# EAGLE design head (EAGLE 7.6.0)
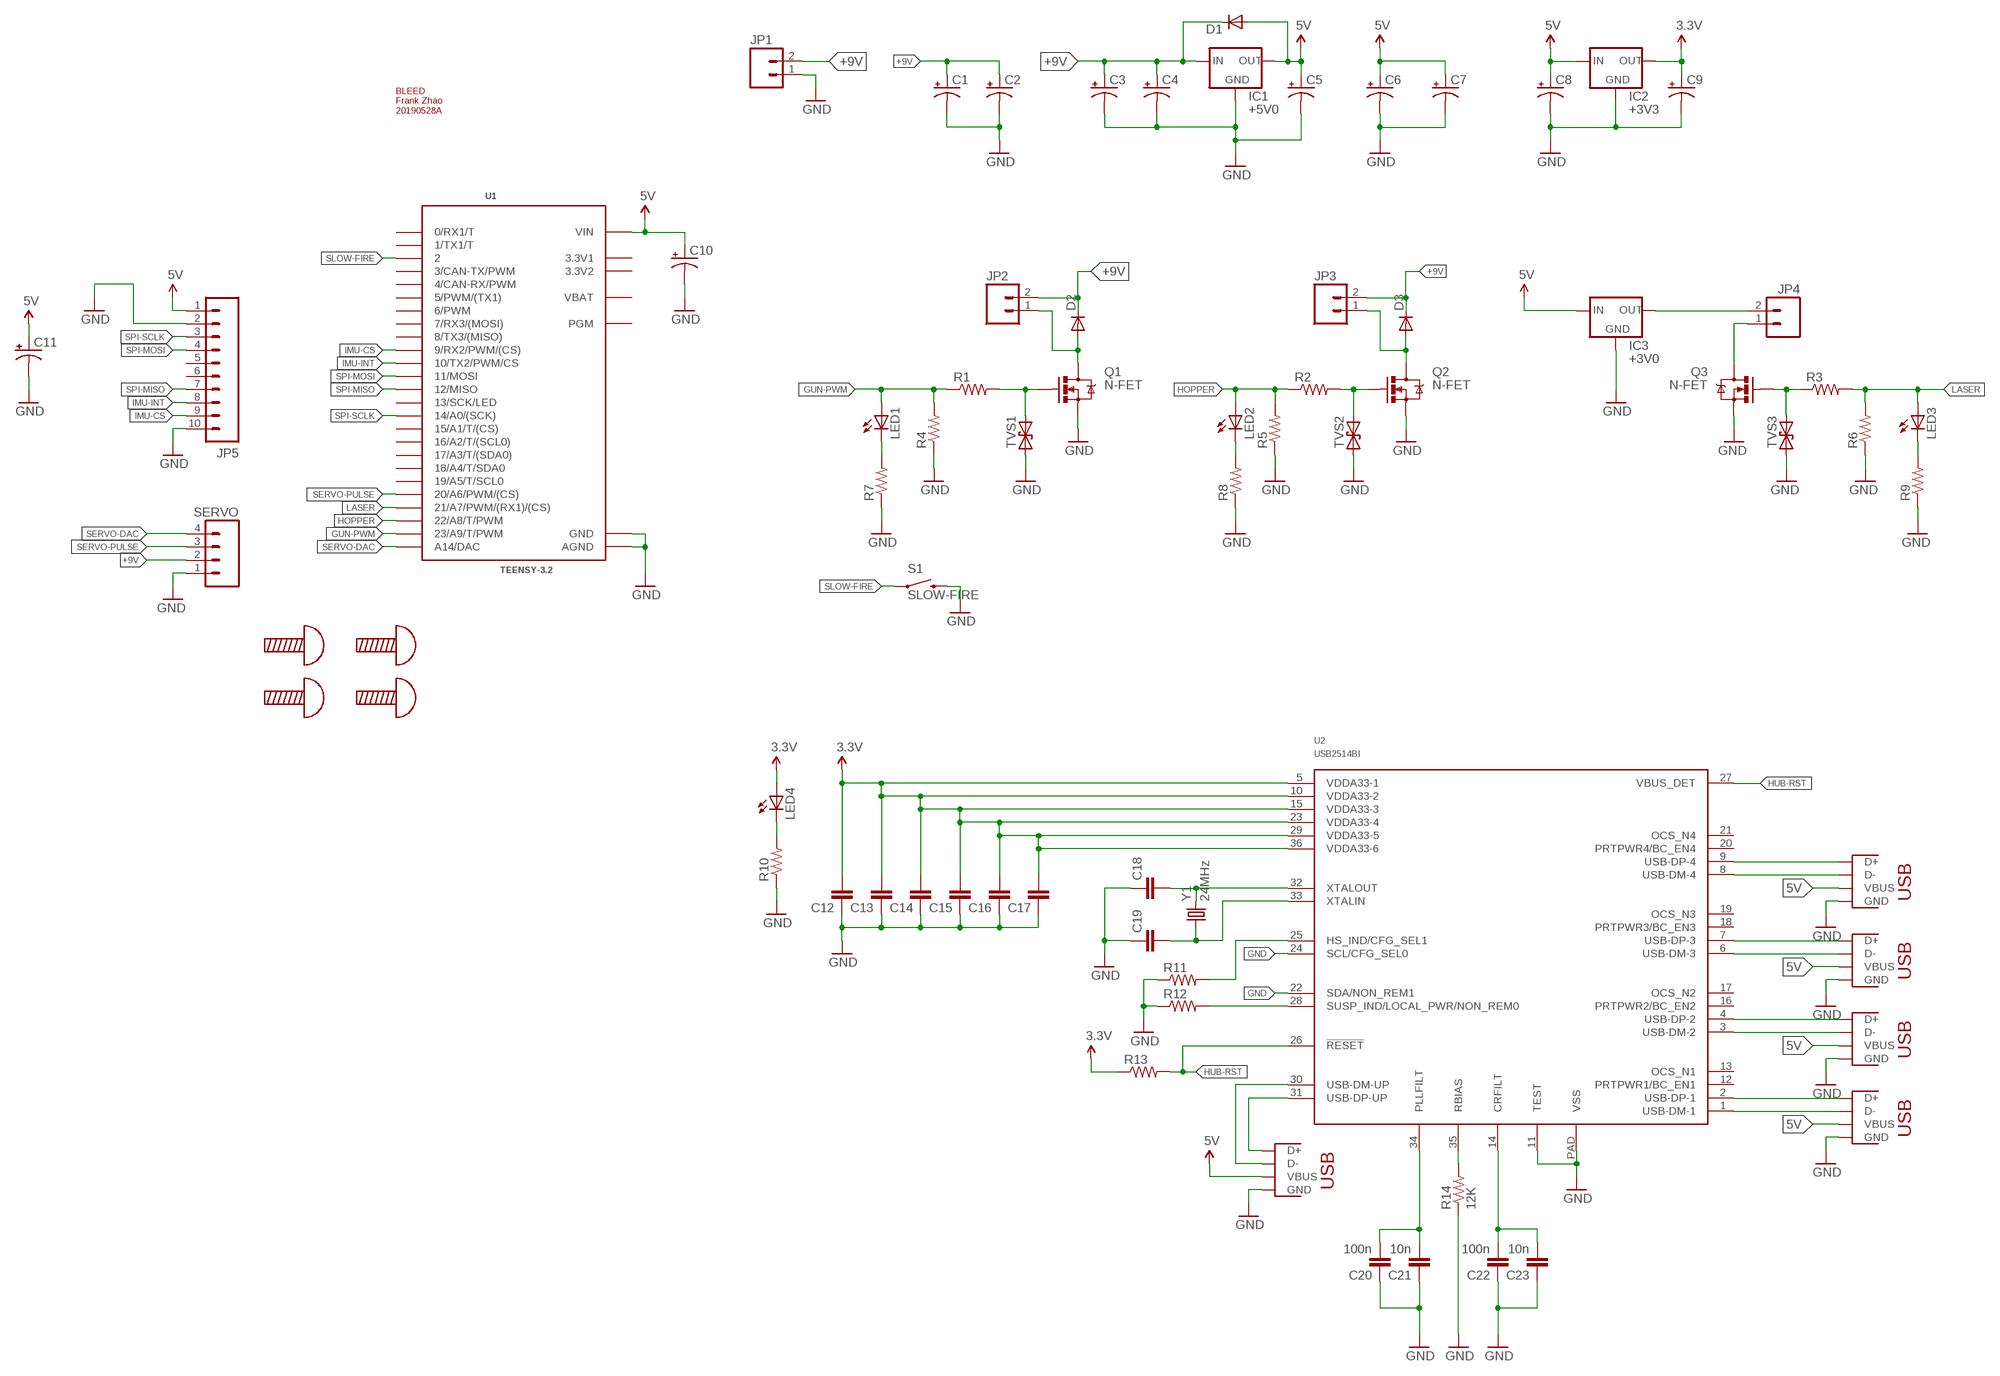
[diagram p0: schematic, sheet 1]

## Parts
C1  CAP_POLPTH4  [CPOL-RADIAL-1000UF-25V]
C2  CAP_POLPTH4  [CPOL-RADIAL-1000UF-25V]
C3  CAP_POLPTH4  [CPOL-RADIAL-1000UF-25V]
C4  CAP_POL1206-KIT  [EIA3216-KIT]
C5  CAP_POL1206-KIT  [EIA3216-KIT]
C6  CAP_POL1206-KIT  [EIA3216-KIT]
C7  CAP_POL1206-KIT  [EIA3216-KIT]
C8  CAP_POL1206-KIT  [EIA3216-KIT]
C9  CAP_POL1206-KIT  [EIA3216-KIT]
C10  CAP_POL1206-KIT  [EIA3216-KIT]
C11  CAP_POL1206-KIT  [EIA3216-KIT]
C12  CAP0402-CAP  [0402-CAP]
C13  CAP0402-CAP  [0402-CAP]
C14  CAP0402-CAP  [0402-CAP]
C15  CAP0402-CAP  [0402-CAP]
C16  CAP0402-CAP  [0402-CAP]
C17  CAP0402-CAP  [0402-CAP]
C18  CAP0402-CAP  [0402-CAP]
C19  CAP0402-CAP  [0402-CAP]
C20  100n  CAP0402-CAP  [0402-CAP]
C21  10n  CAP0402-CAP  [0402-CAP]
C22  100n  CAP0402-CAP  [0402-CAP]
C23  10n  CAP0402-CAP  [0402-CAP]
D1  DIODESMA-KIT  [SMA-DIODE-KIT]
D2  DIODESMA-KIT  [SMA-DIODE-KIT]
D3  DIODESMA-KIT  [SMA-DIODE-KIT]
IC1  +5V0  V_REG_78XX-TO220V  [TO220V]
IC2  +3V3  V_REG_78XX-SOT23  [SOT23]
IC3  +3V0  V_REG_78XX-SOT23  [SOT23]
JP1  M02-TERMBLOCK-3.5MM-OSTTF020161  [TERMBLOCK-X2-OSTTF020161]
JP2  M02-TERMBLOCK-3.5MM-OSTTF020161  [TERMBLOCK-X2-OSTTF020161]
JP3  M02POLAR  [MOLEX-1X2]
JP4  M02JST-PTH-2  [JST-2-PTH]
JP5  M10"  [1X10]
LED1  LED0603  [LED-0603]
LED2  LED0603  [LED-0603]
LED3  LED0603  [LED-0603]
LED4  LED0603  [LED-0603]
LOGO1  LOGO_BLEED  [LOGO_BLEED]
Q1  N-FET  MOSFET-NCHANNELPTH2  [TO220V]
Q2  N-FET  MOSFET-NCHANNELPTH2  [TO220V]
Q3  N-FET  MOSFET-NCHANNELSMD  [SOT23-3]
R1  RESISTOR0603-RES  [0603-RES]
R2  RESISTOR0603-RES  [0603-RES]
R3  RESISTOR0603-RES  [0603-RES]
R4  RESISTOR0603-RES  [0603-RES]
R5  RESISTOR0603-RES  [0603-RES]
R6  RESISTOR0603-RES  [0603-RES]
R7  RESISTOR0603-RES  [0603-RES]
R8  RESISTOR0603-RES  [0603-RES]
R9  RESISTOR0603-RES  [0603-RES]
R10  RESISTOR0402-RES  [0402-RES]
R11  RESISTOR0402-RES  [0402-RES]
R12  RESISTOR0402-RES  [0402-RES]
R13  RESISTOR0402-RES  [0402-RES]
R14  12K  RESISTOR0402-RES  [0402-RES]
S1  SLOW-FIRE  SWITCH-MOMENTARY-2-SMD-1101NE  [TACTILE-SWITCH-1101NE]
SCREW1  SCREW-M3  [SCREW-M3]
SCREW2  SCREW-M3  [SCREW-M3]
SCREW3  SCREW-M3  [SCREW-M3]
SCREW4  SCREW-M3  [SCREW-M3]
SERVO  M04POLAR  [MOLEX-1X4]
TVS1  TVS-SOD323  [SOD-323]
TVS2  TVS-SOD323  [SOD-323]
TVS3  TVS-SOD323  [SOD-323]
U1  TEENSY-3.2  TEENSY_3.1-3.2_OUTER_ROW  [TEENSY_3.0-3.2&LC_OUTER_ROW]
U2  USB2514BI  [QFN-36]
X1  USB-JSTXH-VERT-TH  [1X04-JSTXH-VERT-TH]
X2  USB-JSTXH-VERT-TH  [1X04-JSTXH-VERT-TH]
X3  USB-JSTXH-VERT-TH  [1X04-JSTXH-VERT-TH]
X4  USB-JSTXH-VERT-TH  [1X04-JSTXH-VERT-TH]
X5  USB-JSTXH-VERT-TH  [1X04-JSTXH-VERT-TH]
Y1  24MHz  CRYSTAL5X3  [CRYSTAL-SMD-5X3]

## Nets
3.3V: C9.A(+) C12.2 C13.2 C14.2 C15.2 C16.2 C17.2 IC2.2(OUT) LED4.A R13.1 U2.5(VDDA33-1) U2.10(VDDA33-2) U2.15(VDDA33-3) U2.23(VDDA33-4) U2.29(VDDA33-5) U2.36(VDDA33-6)
5V: C5.A(+) C6.A(+) C7.A(+) C8.A(+) C10.A(+) C11.A(+) D1.A IC1.3(OUT) IC2.3(IN) IC3.3(IN) JP5.1 U1.VIN X1.1(VBUS) X2.1(VBUS) X3.1(VBUS) X4.1(VBUS) X5.1(VBUS)
+9V: C1.1(+) C2.1(+) C3.1(+) C4.A(+) D1.C D2.C D3.C IC1.1(IN) JP1.2 JP2.2 JP3.2 SERVO.2
GND: C1.2(-) C2.2(-) C3.2(-) C4.C(-) C5.C(-) C6.C(-) C7.C(-) C8.C(-) C9.C(-) C10.C(-) C11.C(-) C12.1 C13.1 C14.1 C15.1 C16.1 C17.1 C18.1 C19.1 C20.1 C21.1 C22.1 C23.1 IC1.2(GND) IC2.1(GND) IC3.1(GND) JP1.1 JP5.2 JP5.10 Q1.3(S) Q2.3(S) Q3.2(S) R4.1 R5.1 R6.1 R7.1 R8.1 R9.1 R10.1 R11.1 R12.1 R14.1 S1.2 SERVO.1 TVS1.1 TVS2.1 TVS3.1 U1.AGND U1.GND U1.GND1(GND) U2.11(TEST) U2.22(SDA/NON_REM1) U2.24(SCL/CFG_SEL0) U2.PAD(VSS) X1.4(GND) X2.4(GND) X3.4(GND) X4.4(GND) X5.4(GND)
GUN-PWM: LED1.A R1.1 R4.2 U1.23/A9(23/A9/T/PWM)
HOPPER: LED2.A R2.1 R5.2 U1.22/A8(22/A8/T/PWM)
HUB-RST: R13.2 U2.26(!RESET) U2.27(VBUS_DET)
IMU-CS: JP5.9 U1.9(9/RX2/PWM/(CS))
IMU-INT: JP5.8 U1.10(10/TX2/PWM/CS)
LASER: LED3.A R3.2 R6.2 U1.21/A7(21/A7/PWM/(RX1)/(CS))
N$1: C18.2 U2.32(XTALOUT) Y1.3
N$2: D2.A JP2.1 Q1.2(D)
N$3: LED4.C R10.2
N$4: Q1.1(G) R1.2 TVS1.2
N$5: C19.2 U2.33(XTALIN) Y1.1
N$6: C20.2 C21.2 U2.34(PLLFILT)
N$7: D3.A JP3.1 Q2.2(D)
N$8: Q2.1(G) R2.2 TVS2.2
N$9: JP4.1 Q3.3(D)
N$10: IC3.2(OUT) JP4.2
N$12: LED1.C R7.2
N$13: Q3.1(G) R3.1 TVS3.2
N$14: LED2.C R8.2
N$15: C22.2 C23.2 U2.14(CRFILT)
N$16: LED3.C R9.2
N$19: R14.2 U2.35(RBIAS)
N$21: R11.2 U2.25(HS_IND/CFG_SEL1)
N$22: R12.2 U2.28(SUSP_IND/LOCAL_PWR/NON_REM0)
SERVO-DAC: SERVO.4 U1.RESET/DAC(A14/DAC)
SERVO-PULSE: SERVO.3 U1.20/A6(20/A6/PWM/(CS))
SLOW-FIRE: S1.1 U1.2
SPI-MISO: JP5.7 U1.12(12/MISO)
SPI-MOSI: JP5.4 U1.11(11/MOSI)
SPI-SCLK: JP5.3 U1.14/A0(14/A0/(SCK))
USB_DOWN1_D_N [USB diff pair]: U2.1(USB-DM-1) X4.3(D-)
USB_DOWN1_D_P [USB diff pair]: U2.2(USB-DP-1) X4.2(D+)
USB_DOWN2_D_N [USB diff pair]: U2.3(USB-DM-2) X3.3(D-)
USB_DOWN2_D_P [USB diff pair]: U2.4(USB-DP-2) X3.2(D+)
USB_DOWN3_D_N [USB diff pair]: U2.6(USB-DM-3) X2.3(D-)
USB_DOWN3_D_P [USB diff pair]: U2.7(USB-DP-3) X2.2(D+)
USB_DOWN4_D_N [USB diff pair]: U2.8(USB-DM-4) X1.3(D-)
USB_DOWN4_D_P [USB diff pair]: U2.9(USB-DP-4) X1.2(D+)
USB_UP_D_N [USB diff pair]: U2.31(USB-DP-UP) X5.2(D+)
USB_UP_D_P [USB diff pair]: U2.30(USB-DM-UP) X5.3(D-)
Unconnected: JP5.5 JP5.6 U1.0(0/RX1/T) U1.1(1/TX1/T) U1.3(3/CAN-TX/PWM) U1.4(4/CAN-RX/PWM) U1.5(5/PWM/(TX1)) U1.6(6/PWM) U1.7(7/RX3/(MOSI)) U1.8(8/TX3/(MISO)) U1.13(13/SCK/LED) U1.15/A1(15/A1/T/(CS)) U1.16/A2(16/A2/T/(SCL0)) U1.17/A3(17/A3/T/(SDA0)) U1.18/A4(18/A4/T/SDA0) U1.19/A5(19/A5/T/SCL0) U1.PGM U2.12(PRTPWR1/BC_EN1) U2.13(OCS_N1) U2.16(PRTPWR2/BC_EN2) U2.17(OCS_N2) U2.18(PRTPWR3/BC_EN3) U2.19(OCS_N3) U2.20(PRTPWR4/BC_EN4) U2.21(OCS_N4)

## Power pins joined to a net without a drawn wire
3.3V1: U1.3.3V1
3.3V2: U1.3.3V2
VBAT: U1.VBAT

## Library data of the parts
C1-C11 = bleed:CAP_POL: Capacitor Polarized These are standard SMD and PTH capacitors. Normally 10uF, 47uF, and 100uF in electrolytic and tantalum varieties. Always verify the external diameter of the through hole cap, it varies with capacity, voltage, and manufacturer. The EIA devices should be standard.
C12-C23 = bleed:CAP: Capacitor Standard 0603 ceramic capacitor, and 0.1" leaded capacitor.
D1-D3 = bleed:DIODE: Diode These are standard reverse protection diodes and small signal diodes. SMA package can handle up to about 1A. SOD-323 can handle about 200mA. What the SOD-323 package when ordering, there are some mfgs out there that are 5-pin packages.
IC1-IC3 = bleed:V_REG_78XX: Voltage Regulator Standard 7805 5V regulator. IGO (Input Ground Output). Spark Fun Electronics SKU : COM-00107
JP1-JP4 = bleed:M02: Header 2 Standard 2-pin 0.1" header. Use with straight break away headers (SKU : PRT-00116), right angle break away headers (PRT-00553), swiss pins (PRT-00743), machine pins (PRT-00117), and female headers (PRT-00115). Molex polarized connector foot print use with SKU : PRT-08233 with associated crimp pins and housings.
JP5 = bleed:M10: Header 10 Standard 10-pin 0.1" header. Use with straight break away headers (SKU : PRT-00116), right angle break away headers (PRT-00553), swiss pins (PRT-00743), machine pins (PRT-00117), and female headers (PRT-00115).
LED1-LED4 = bleed:LED: LEDs Standard schematic elements and footprints for 5mm, 3mm, 1206, and 0603 sized LEDs. 5mm - Spark Fun Electronics SKU : COM-00529 (and others)
LOGO1 = bleed:LOGO_BLEED
Q1-Q3 = bleed:MOSFET-NCHANNEL
R1-R14 = bleed:RESISTOR: Resistor Basic schematic elements and footprints for 0603, 1206, and PTH resistors.
S1 = bleed:SWITCH-MOMENTARY-2
SCREW1-SCREW4 = bleed:SCREW
SERVO = bleed:M04: Header 4 Standard 4-pin 0.1" header. Use with straight break away headers (SKU : PRT-00116), right angle break away headers (PRT-00553), swiss pins (PRT-00743), machine pins (PRT-00117), and female headers (PRT-00115). Molex polarized connector foot print use with SKU : PRT-08231 with associated crimp pins and housings. 1MM SMD Version SKU: PRT-10208
TVS1-TVS3 = bleed:TVS
U1 = bleed:TEENSY_3.1-3.2_OUTER_ROW: Footprint for Teensy 3.1 or 3.2 board using all pin connections on the outer perimeter
U2 = bleed:USB2514BI
X1-X5 = bleed:USB: USB Connectors USB-B-PTH is fully proven SKU : PRT-00139 USB-miniB is fully proven SKU : PRT-00587 USB-A-PCB is untested. USB-A-H is throughly reviewed, but untested. Spark Fun Electronics SKU : PRT-00437 USB-B-SMT is throughly reviewed, but untested. Needs silkscreen touching up. USB-A-S has not been used/tested USB-MB-H has not been used/tested
Y1 = bleed:CRYSTAL: Crystals Various standard crystals. Proven footprints. Spark Fun Electronics SKU : COM-00534

## Net classes
1 USB diff pair: width 0.16 mm, drill 0.3 mm, clearance 0.16 mm

## Board
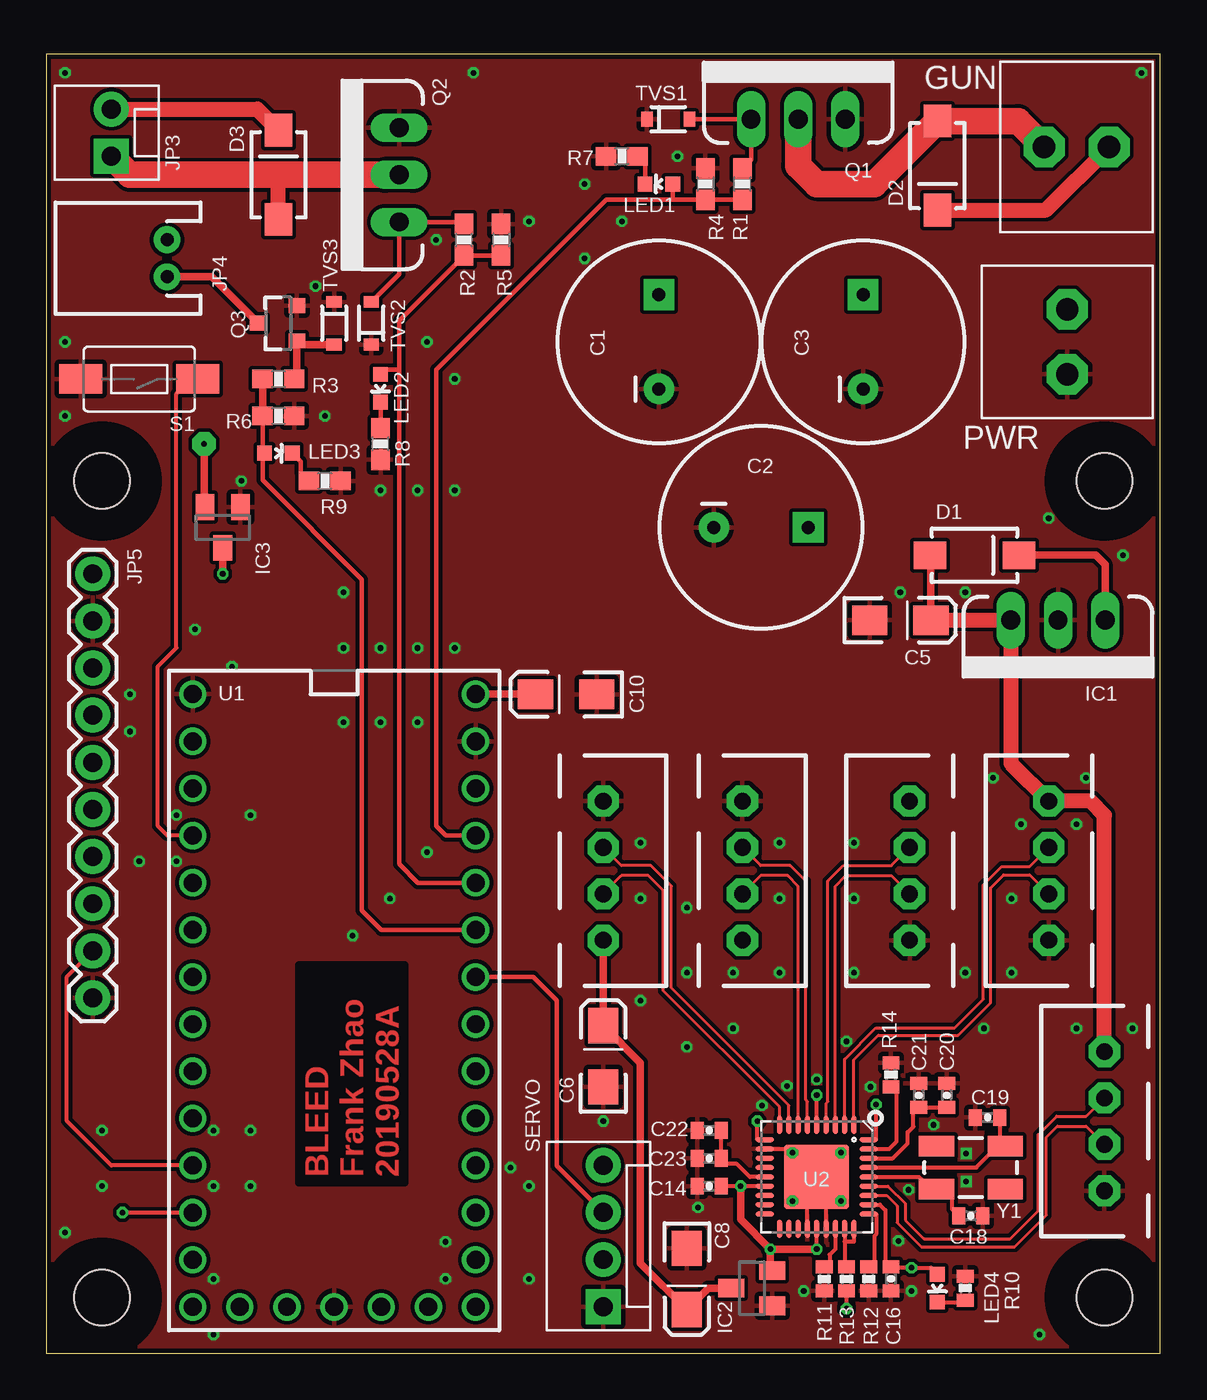
[diagram p1: board, top side]
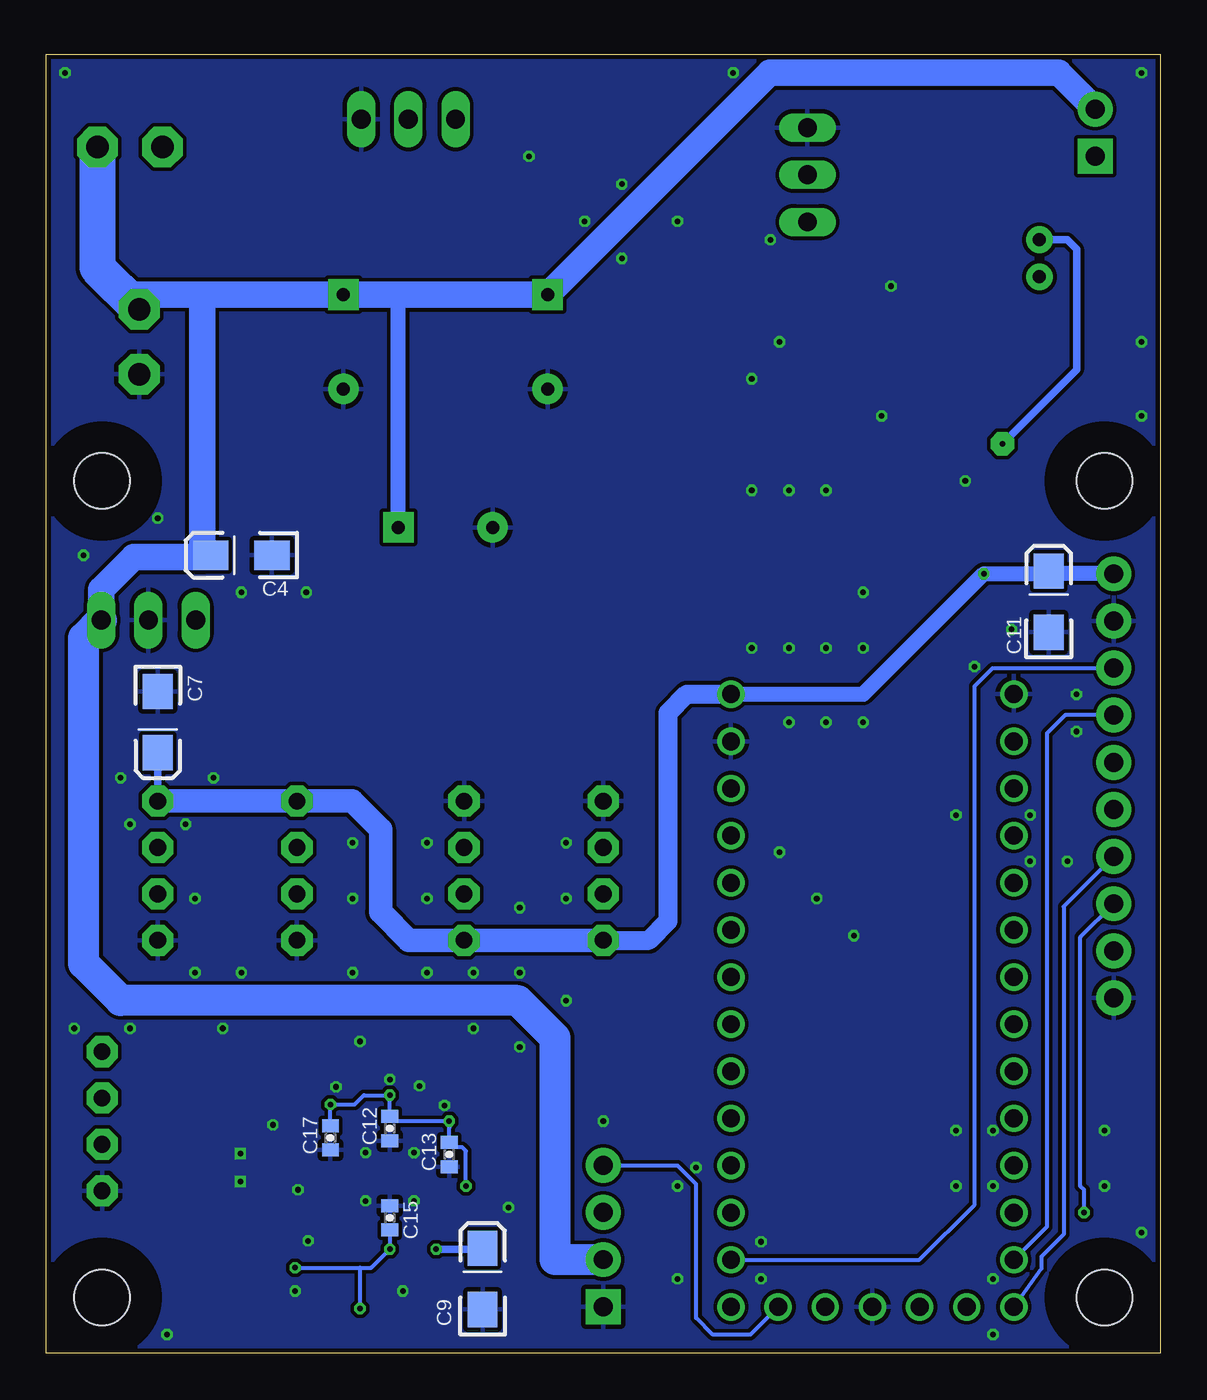
[diagram p2: board, bottom side, seen from below]

Size 60 x 70 mm. Coordinates in mm from the lower left corner, seen from the top.
Outline: 0,0 60,0 60,70 0,70 0,0
Copper layers (1*16): Top 0.035mm / dielectric 1.5mm / Bottom 0.035mm
Design rules "Fusion_eagle_rule_v1.1_TentedVias3": minimum track width 6mil, minimum drill 0.3mm, track to track 7mil, track to pad 7mil, pad to pad 7mil, via to via 7mil, smd to smd 0mil, copper to edge 10mil, drill to drill 10mil, minimum pad ring 10mil, minimum via ring 6mil, stop-mask expansion 2mil, vias tented up to drill 25mil, thermal gap 10mil

### Footprints (pad centres in the part's own frame; a part is rotated, then mirrored left to right if it is on the bottom)
CPOL-RADIAL-1000UF-25V = drill 0.7 pad 1.651 square: 1 2.54,0 | drill 0.7 pad 1.651: 2 -2.54,0
EIA3216-KIT = smd 1.9 x 1.6: A 1.65,0; C -1.65,0
0402-CAP = smd 0.7 x 0.9: 1 -0.65,0; 2 0.65,0
SMA-DIODE-KIT = smd 1.77 x 1.47: A -2.4,0; C 2.4,0
TO220V = drill 1.016 long: 1 -2.54,0; 2 0,0; 3 2.54,0
SOT23 = smd 1 x 1.4: 1 -0.95,-1.1; 2 0.95,-1.1; 3 0,1.1
TERMBLOCK-X2-OSTTF020161 = drill 1.2 pad 2.2 octagon: 1 -1.75,0; 2 1.75,0
MOLEX-1X2 = drill 1.016 pad 1.88 square: 1 0,0 | drill 1.016 pad 1.88: 2 2.54,0
JST-2-PTH = drill 0.7 pad 1.448: 1 -1,0; 2 1,0
1X10 = drill 1.016 pad 1.88: 1 0,0; 2 2.54,0; 3 5.08,0; 4 7.62,0; 5 10.16,0; 6 12.7,0; 7 15.24,0; 8 17.78,0; 9 20.32,0; 10 22.86,0
LED-0603 = smd 0.8 x 0.8: A 0,-0.75; C 0,0.75
SOT23-3 = smd 0.8 x 0.9: 1 -0.95,-1; 2 0.95,-1; 3 0,1.1
0603-RES = smd 1.1 x 1: 1 -0.85,0; 2 0.85,0
0402-RES = smd 0.7 x 0.9: 1 -0.65,0; 2 0.65,0
TACTILE-SWITCH-1101NE = smd 2.3 x 1.6: 1 -3.15,0; 2 3.15,0
SCREW-M3 = hole 3: 0,0
MOLEX-1X4 = drill 1.016 pad 1.88 square: 1 0,0 | drill 1.016 pad 1.88: 2 2.54,0; 3 5.08,0; 4 7.62,0
SOD-323 = smd 0.63 x 0.83: 1 -1.15,0; 2 1.15,0
TEENSY_3.0-3.2&LC_OUTER_ROW = drill 0.965: 0 -7.62,13.97; 1 -7.62,11.43; 2 -7.62,8.89; 3 -7.62,6.35; 3.3V1 7.62,11.43; 3.3V2 -2.54,-16.51; 4 -7.62,3.81; 5 -7.62,1.27; 6 -7.62,-1.27; 7 -7.62,-3.81; 8 -7.62,-6.35; 9 -7.62,-8.89; 10 -7.62,-11.43; 11 -7.62,-13.97; 12 -7.62,-16.51; 13 7.62,-16.51; 14/A0 7.62,-13.97; 15/A1 7.62,-11.43; 16/A2 7.62,-8.89; 17/A3 7.62,-6.35; 18/A4 7.62,-3.81; 19/A5 7.62,-1.27; 20/A6 7.62,1.27; 21/A7 7.62,3.81; 22/A8 7.62,6.35; 23/A9 7.62,8.89; AGND 7.62,13.97; GND -7.62,16.51; GND1 0,-16.51; PGM 2.54,-16.51; RESET/DAC 5.08,-16.51; VBAT -5.08,-16.51; VIN 7.62,16.51
QFN-36 = smd 0.28 x 1: 1 -2,-2.8; 2 -1.5,-2.8; 3 -1,-2.8; 4 -0.5,-2.8; 5 0,-2.8; 6 0.5,-2.8; 7 1,-2.8; 8 1.5,-2.8; 9 2,-2.8; 19 2,2.8; 20 1.5,2.8; 21 1,2.8; 22 0.5,2.8; 23 0,2.8; 24 -0.5,2.8; 25 -1,2.8; 26 -1.5,2.8; 27 -2,2.8 | smd 1 x 0.28: 10 2.8,-2; 11 2.8,-1.5; 12 2.8,-1; 13 2.8,-0.5; 14 2.8,0; 15 2.8,0.5; 16 2.8,1; 17 2.8,1.5; 18 2.8,2; 28 -2.8,2; 29 -2.8,1.5; 30 -2.8,1; 31 -2.8,0.5; 32 -2.8,0; 33 -2.8,-0.5; 34 -2.8,-1; 35 -2.8,-1.5; 36 -2.8,-2 | smd 3.5 x 3.5: PAD 0,0
1X04-JSTXH-VERT-TH = drill 0.9 pad 1.676 octagon: 1 -3.75,0; 2 -1.25,0; 3 1.25,0; 4 3.75,0
CRYSTAL-SMD-5X3 = smd 1.9 x 1.1: 1 -1.85,-1.15; 2 1.85,-1.15; 3 1.85,1.15; 4 -1.85,1.15

### Placement (x,y rotation side)
C1  33,54.5 90 top
C2  38.5,44.5 0 top
C3  44,54.5 90 top
C4  49.5,43 180 bottom
C5  46,39.5 0 top
C6  30,16 90 top
C7  54,34 270 bottom
C8  34.5,4 270 top
C9  36.5,4 90 bottom
C10  28,35.5 180 top
C11  6,40.5 90 bottom
C12  41.5,12.1 90 bottom
C13  38.3,10.7 90 bottom
C14  35.7,9 0 top
C15  41.5,7.3 270 bottom
C16  45.5,4 90 top
C17  44.7,11.6 90 bottom
C18  49.8,7.4 180 top
C19  50.7,12.7 0 top
C20  48.5,13.9 270 top
C21  47,13.9 270 top
C22  35.7,12 0 top
C23  35.7,10.5 0 top
D1  50,43 0 top
D2  48,64 270 top
D3  12.5,63.5 90 top
IC1  54.5,39.5 180 top
IC2  38,3.5 90 top
IC3  9.5,44.5 180 top
JP1  55,54.5 90 top
JP2  55.5,65 0 top
JP3  3.5,64.5 90 top
JP4  6.5,59 90 top
JP5  2.5,42 270 top
LED1  33,63 90 top
LED2  18,52 180 top
LED3  12.5,48.5 270 top
LED4  48,3.5 180 top
LOGO1  19,9.5 90 top
Q1  40.5,66.5 0 top
Q2  19,63.5 90 top
Q3  12.5,55.5 90 top
R1  37.5,63 90 top
R2  22.5,60 90 top
R3  12.5,52.5 180 top
R4  35.5,63 270 top
R5  24.5,60 270 top
R6  12.5,50.5 180 top
R7  31,64.5 0 top
R8  18,49 90 top
R9  15,47 180 top
R10  49.5,3.5 270 top
R11  41.9,4 90 top
R12  44.3,4 90 top
R13  43.1,4 90 top
R14  45.5,15 270 top
S1  5,52.5 180 top
SCREW1  57,47 0 top
SCREW2  3,3 0 top
SCREW3  3,47 0 top
SCREW4  57,3 0 top
SERVO  30,2.5 90 top
TVS1  33.5,66.5 0 top
TVS2  17.5,55.5 90 top
TVS3  15.5,55.5 270 top
U1  15.5,19 0 top
U2  41.5,9.5 180 top
X1  30,26 90 top
X2  37.5,26 90 top
X3  46.5,26 270 top
X4  54,26 270 top
X5  57,12.5 270 top
Y1  49.8,10 180 top

### Tracks (layer width: path | path; a pad name or v marks a point on that pad's centre or on a via)
3.3V  (via drill 0.3)
  Top 0.203: U2.36 44.7,11.5 v44.7,13.4 | U2.29 44.9,8 45.2,7.7 45.2,4.65 C16.2 45.5,4.6 v46.6,4.6 47.65,4.6 LED4.A | U2.5 v41.5,13.9 | U2.10 38.3,11.5 v38.3,12.5 | U2.15 v37.4,9 C14.2 | R13.1 v43.1,2.4 | v41.5,5.6 U2.23
  Top 0.406: v41.5,5.6 v39,5.6 | v39,5.6 37.4,7.2 v37.4,9 | IC2.2 39,4.45 v39,5.6
  Bottom 0.203: v38.3,12.5 38.3,12.1 | v38.3,12.5 C13.2 38.05,11.1 37.6,11.1 37.4,10.9 v37.4,9 | C17.2 v44.7,13.4 43.4,13.4 42.9,13.9 v41.5,13.9 C12.2 41.25,12.5 v38.3,12.5 | v46.6,4.6 43.1,4.6 | 43.1,4.6 42.5,4.6 v41.5,5.6 C15.2 | v43.1,2.4 43.1,4.6
  Bottom 0.406: C9.A 36.5,5.6 v39,5.6
5V  (via drill 0.3)
  Top 0.406: IC2.3 35.65,3.5 C8.A 32,4.85 32,15.65 C6.A X1.1 | IC3.3 v9.5,42 | C5.A 47.65,42.95 D1.A | C10.A U1.VIN
  Top 0.813: C5.A IC1.3 51.96,31.79 X4.1 56.25,29.75 57,29 X5.1
  Bottom 0.406: 6.15,42 C11.A 5.85,42 | C7.A X4.1 54.5,29.75
  Bottom 0.813: U1.VIN 15.99,35.51 v9.5,42 6.15,42 | JP5.1 5.85,42
  Bottom 1.016: X1.1 27.53,22.25 26.5,23.28 26.5,34.5 25.49,35.51 U1.VIN
  Bottom 1.27: X4.1 X3.1 43.52,29.75 42,28.23 42,23.77 40.48,22.25 X2.1 X1.1
+9V
  Top 0.406: D1.C 56.54,43 57.04,42.5 IC1.1
  Top 0.813: JP3.2 11.36,67.04 D3.C | D2.C 53.85,61.6 JP2.2
  Bottom 0.813: C4.A 51.6,43 51.6,43.5 | C2.1 41.04,57.04 41.5,57.04
  Bottom 1.422: 51.6,57.04 C3.1 41.5,57.04 C1.1 21.04,69 5.46,69 JP3.2 | 51.6,57.04 55,57.04 JP1.2 | IC1.1 57.04,41.16 55.3,42.9 51.6,42.9 51.6,43.5 51.6,57.04
  Bottom 1.676: SERVO.2 32.6,5.04 32.6,17 34.6,19 56,19 58,21 58,38.54 IC1.1
  Bottom 1.93: JP2.2 57.25,58.5 JP1.2
GND  (via drill 0.3)
  Top 0.203: 39,11 40,11 | U2.24 42,9.5 U2.PAD 41,9.5 U2.22
  Top 0.406: v40.2,10.8 U2.PAD
  other vias: 45.9,6.05 42.8,8.2 42.8,10.8 40.2,8.2 44.4,14.35 47.8,12.3 46.6,3.35 40.8,3.35 35.1,7.85 46.45,8.8 49.55,9.25 49.55,10.75 41.5,14.75 38.55,13.35 39.9,14.4 43.1,16.8 58.5,17.5 55.5,17.5 56,31 55.5,28.5 52.5,28.5 51,31 49.5,41 46,41 58,43 54,45 10.5,47 15,50.5 14.5,57.5 1,50.5 1,54.5 34,64.5 34.5,16.5 32,19 37,17.5 37,20.5 43.5,20.5 39.5,20.5 50.5,17.5 52,20.5 49.5,20.5 8,39 26,61 31,61 29,63 29,59 18,46.5 20,46.5 22,52.5 20.5,54.5 21,60 22,46.5 16,41 18,38 20,38 22,38 18,34 20,34 16,34 16,38 23,69 20.5,27 18.5,24.5 16.5,22.5 10,37 3,9 9,9 11,9 3,12 9,12 11,12 9,4 9,1 21.5,6 21.5,4 26,4 26,9 25,10 30,12.5 7,26.5 7,29 5,26.5 11,29 4.5,35.5 4.5,33.5 32,24.5 39.5,24.5 43.5,24.5 52,24.5 43.5,27.5 39.5,27.5 32,27.5 34.5,24 34.5,20.5 1,69 59,69 53.5,1 1,6.5
  pour Top (isolate 0.203): 0,0 60,0 60,70 0,70
  pour Bottom (isolate 0.203): 0,0 60,0 60,70 0,70
GUN-PWM
  Top 0.254: U1.23/A9 21.51,27.89 21,28.4 21,53 30.15,62.15 33.75,62.15 | R1.1 R4.2 34,62.15 33.75,62.15 | LED1.A 33.75,62.15
HOPPER
  Top 0.254: U1.22/A8 20.01,25.35 19,26.36 19,53 | 19,53 19,55.65 R2.1 R5.2 | LED2.A 18,53 19,53
HUB-RST
  Top 0.203: U2.26 43,6 | 43,6 43,4.65 R13.2 | U2.27 43.5,6 43,6
IMU-CS
  Top 0.203: U1.9 3.5,10.11 1.1,12.51 1.1,20.28 JP5.9
IMU-INT  (via drill 0.3)
  Top 0.203: U1.10 v4.1,7.57
  Bottom 0.203: v4.1,7.57 4.1,8.8 4.3,9 4.3,22.42 JP5.8
LASER
  Top 0.254: U1.21/A7 18.05,22.81 17,23.86 17,41.7 11.65,47.05 11.65,48.5 | R6.2 11.65,49 11.65,48.5 | LED3.A 11.65,48.5
  Top 0.406: R6.2 R3.2
N$1
  Top 0.203: U2.32 47,9.5 47.2,9.3 Y1.3 48.8,8.5 48.8,7.75 C18.2
N$2
  Top 1.422: Q1.2 40.5,64 41.5,63 44.6,63 D2.A 52.35,66.4 JP2.1
N$3
  Top 0.203: LED4.C 49.4,2.75 R10.2
N$4
  Top 0.254: R1.2 37.96,64.31 Q1.1 TVS1.2
N$5
  Top 0.203: U2.33 50.1,10 50.8,10.7 Y1.1 51.35,11.45 C19.2
N$6
  Top 0.203: U2.34 45.6,10.5 46.4,11.3 46.4,11.9 46.7,12.2 46.7,13.25 C21.2 C20.2
N$7
  Top 0.813: D3.A 12.5,63.5 13,63.5
  Top 1.422: JP3.1 4.5,63.5 13,63.5 Q2.2
N$8
  Top 0.254: R2.2 22.5,60.96 Q2.1 19,58.15 TVS2.2
N$9
  Top 0.406: JP4.1 8.9,58 Q3.3
N$10  (via drill 0.3 pad 1.27)
  Top 0.406: v8.5,49 8.5,45.65 IC3.2
  Bottom 0.406: JP4.2 5,60 4.5,59.5 4.5,53 v8.5,49
N$12
  Top 0.254: LED1.C 32.25,64.5 R7.2
N$13
  Top 0.406: R3.1 13.5,52.65 Q3.1 13.7,54.35 TVS3.2
N$14
  Top 0.254: LED2.C R8.2
N$15
  Top 0.203: U2.14 37.9,9.5 37.2,10.2 36.35,10.2 C23.2 C22.2
N$16
  Top 0.254: LED3.C 13.7,48.05 13.7,47.45 R9.2
N$19
  Top 0.203: U2.35 45.4,11 45.8,11.4 45.8,14.25 R14.2
N$21
  Top 0.203: U2.25 42.5,5.6 42.2,5.3 42.2,4.65 R11.2
N$22
  Top 0.203: U2.28 44.7,7.5 44.7,6.4 44.6,6.3 44.6,4.95 R12.2
SERVO-DAC
  Bottom 0.203: U1.RESET/DAC 22.07,1 24.1,1 25,1.9 25,9.1 26,10.1 29.98,10.1 SERVO.4
SERVO-PULSE
  Top 0.254: U1.20/A6 26.23,20.27 27.5,19 27.5,10.08 SERVO.3
SLOW-FIRE
  Top 0.203: U1.2 6.51,27.89 6,28.4 6,37 7,38 7,51.7 7.8,52.5 S1.1
SPI-MISO
  Bottom 0.203: JP5.7 5.2,24.06 5.2,6.4 6.4,5.2 6.4,4.57 U1.12
SPI-MOSI
  Bottom 0.203: JP5.4 5.12,34.38 6.1,33.4 6.1,6.81 U1.11
SPI-SCLK
  Bottom 0.203: U1.14/A0 12.97,5.03 10,8 10,35.94 9.02,36.92 JP5.3
USB_DOWN1_D_N
  Top 0.16: U2.1 43.5,15.81 44.82,17.13 49.12,17.13 50.87,18.88 50.87,25.08 51.57,25.78 52.97,25.78 X4.3
USB_DOWN1_D_P
  Top 0.16: U2.2 43,15.84 44.68,17.52 48.93,17.52 50.48,19.07 50.48,25.22 51.48,26.22 52.97,26.22 X4.2
USB_DOWN2_D_N
  Top 0.16: U2.3 42.5,25.16 43.07,25.73 45.52,25.73 X3.3
USB_DOWN2_D_P
  Top 0.16: U2.4 42,13.45 42.1,13.55 42.1,25.44 42.93,26.27 45.52,26.27 X3.2
USB_DOWN3_D_N
  Top 0.16: U2.6 41,13.55 40.9,13.65 40.9,25.44 40.07,26.27 38.48,26.27 X2.3
USB_DOWN3_D_P
  Top 0.16: U2.7 40.5,25.16 39.93,25.73 38.48,25.73 X2.2
USB_DOWN4_D_N
  Top 0.16: U2.8 40,13.34 33.67,19.67 33.67,25.17 32.57,26.27 30.98,26.27 X1.3
USB_DOWN4_D_P
  Top 0.16: U2.9 39.5,13.26 33.23,19.53 33.23,24.93 32.43,25.73 30.98,25.73 X1.2
USB_UP_D_N
  Top 0.16: U2.31 45.34,9 46.27,8.07 46.27,7.17 47.27,6.17 51.93,6.17 53.43,7.67 53.43,11.77 54.43,12.77 56.02,12.77 X5.2
USB_UP_D_P
  Top 0.16: U2.30 45.26,8.5 45.83,7.93 45.83,7.03 47.13,5.73 52.17,5.73 53.87,7.43 53.87,11.63 54.47,12.23 56.02,12.23 X5.3

### Text on the board
tNames: GUN | PWR